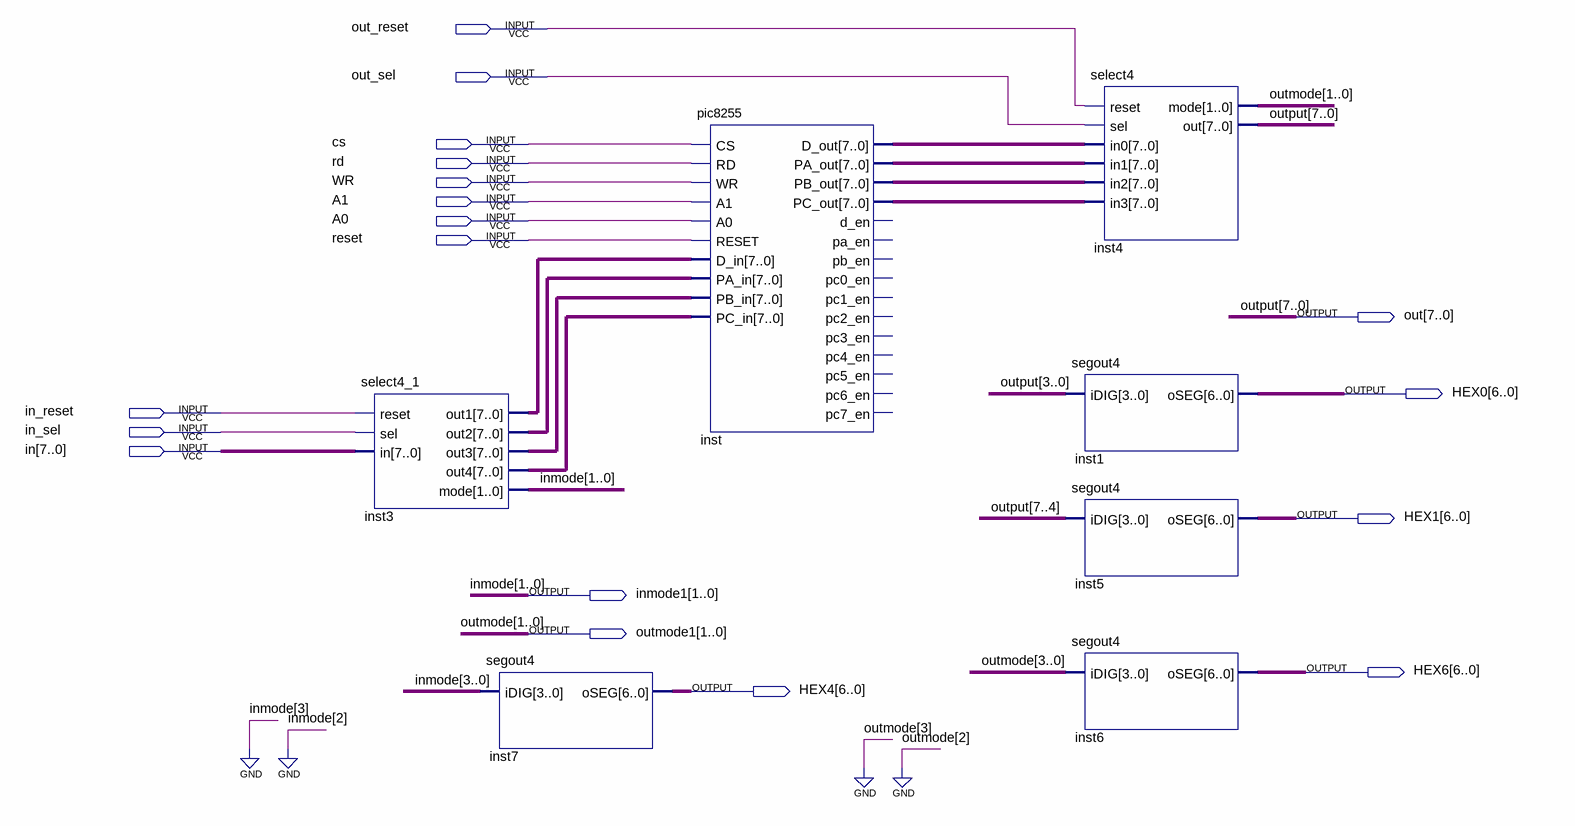
[diagram p0: schematic sheet]
// Quartus schematic 8255_down.bdf as structural Verilog: 7 symbols, 18 pins
module \8255_down  (
  input  out_reset,
  input  out_sel,
  input  cs,
  input  rd,
  input  WR,
  input  A1,
  input  A0,
  input  reset,
  input  in_reset,
  input  in_sel,
  input  [7:0] in,
  output [7:0] out,
  output [6:0] HEX0,
  output [6:0] HEX1,
  output [1:0] inmode1,
  output [1:0] outmode1,
  output [6:0] HEX6,
  output [6:0] HEX4
);

  wire [7:0] inst3_out1, inst3_out2, inst3_out3, inst3_out4, inst_d_out, inst_pa_out, inst_pb_out,
       inst_pc_out;

  select4_1 inst3 (
    .reset(in_reset), .sel(in_sel), .in(in), .out1(inst3_out1), .out2(inst3_out2), .out3(inst3_out3),
    .out4(inst3_out4), .mode(inmode1));
  segout4 inst7 (.iDIG({2'b00, inmode1}), .oSEG(HEX4));
  pic8255 inst (
    .CS(cs), .RD(rd), .WR(WR), .A1(A1), .A0(A0), .RESET(reset), .D_in(inst3_out1), .PA_in(inst3_out2),
    .PB_in(inst3_out3), .PC_in(inst3_out4), .D_out(inst_d_out), .PA_out(inst_pa_out), .PB_out(inst_pb_out),
    .PC_out(inst_pc_out));  // open: d_en, pa_en, pb_en, pc0_en, pc1_en, pc2_en, pc3_en, pc4_en, pc5_en, pc6_en, pc7_en
  select4 inst4 (
    .reset(out_reset), .sel(out_sel), .in0(inst_d_out), .in1(inst_pa_out), .in2(inst_pb_out),
    .in3(inst_pc_out), .mode(outmode1), .out(out));
  segout4 inst1 (.iDIG(out[3:0]), .oSEG(HEX0));
  segout4 inst5 (.iDIG(out[7:4]), .oSEG(HEX1));
  segout4 inst6 (.iDIG({2'b00, outmode1}), .oSEG(HEX6));

  // Other names for the same wires on the sheet: inmode[1:0] = inmode1; outmode[1:0] = outmode1; output[7:0] = out
endmodule
